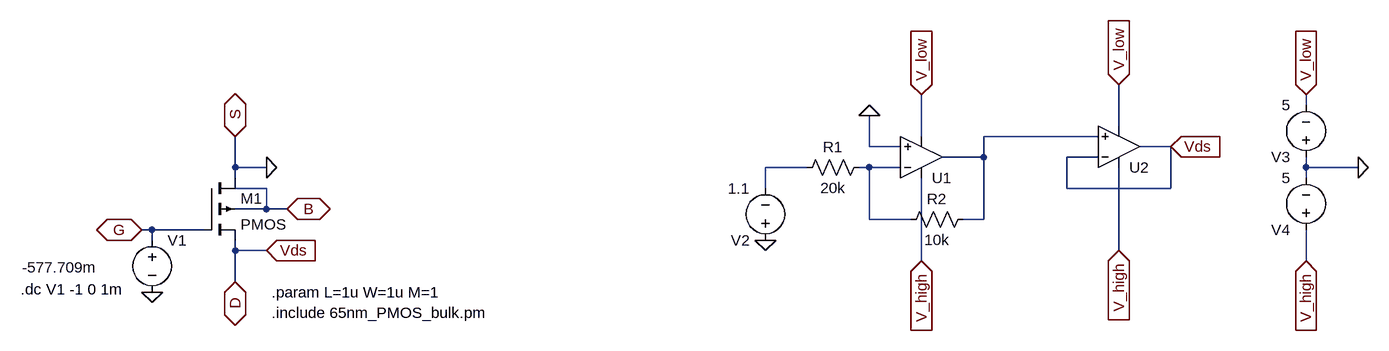
[diagram p0: schematic pmos65_trial1.asc]
pmos65_trial1.asc, the LTspice schematic file:
Version 4
SHEET 1 1956 680
WIRE 1856 0 1856 -16
WIRE 1568 32 1568 -32
WIRE 1264 48 1264 -16
WIRE 1536 48 1360 48
WIRE 1184 64 1184 16
WIRE 1232 64 1184 64
WIRE 1648 64 1600 64
WIRE 1360 80 1360 48
WIRE 1360 80 1296 80
WIRE 1536 80 1488 80
WIRE 208 96 208 48
WIRE 256 96 208 96
WIRE 1088 96 1024 96
WIRE 1184 96 1168 96
WIRE 1232 96 1184 96
WIRE 1856 96 1856 80
WIRE 1936 96 1856 96
WIRE 208 112 208 96
WIRE 1856 112 1856 96
WIRE 256 128 208 128
WIRE 1024 128 1024 96
WIRE 1488 128 1488 80
WIRE 1648 128 1648 64
WIRE 1648 128 1488 128
WIRE 256 160 256 128
WIRE 256 160 208 160
WIRE 288 160 256 160
WIRE 1184 176 1184 96
WIRE 1248 176 1184 176
WIRE 1360 176 1360 80
WIRE 1360 176 1328 176
WIRE 80 192 64 192
WIRE 160 192 80 192
WIRE 80 208 80 192
WIRE 208 224 208 208
WIRE 256 224 208 224
WIRE 1568 224 1568 96
WIRE 1264 240 1264 112
WIRE 1856 240 1856 192
WIRE 208 272 208 224
FLAG 64 192 G
IOPIN 64 192 BiDir
FLAG 208 272 D
IOPIN 208 272 BiDir
FLAG 208 48 S
IOPIN 208 48 BiDir
FLAG 288 160 B
IOPIN 288 160 BiDir
FLAG 80 288 0
FLAG 256 96 0
FLAG 256 224 Vds
IOPIN 256 224 In
FLAG 1184 16 0
FLAG 1024 208 0
FLAG 1936 96 0
FLAG 1856 -16 V_low
IOPIN 1856 -16 In
FLAG 1856 240 V_high
IOPIN 1856 240 In
FLAG 1264 -16 V_low
IOPIN 1264 -16 In
FLAG 1568 -32 V_low
IOPIN 1568 -32 In
FLAG 1568 224 V_high
IOPIN 1568 224 In
FLAG 1264 240 V_high
IOPIN 1264 240 In
FLAG 1648 64 Vds
IOPIN 1648 64 In
SYMBOL pmos4 160 112 R0
SYMATTR InstName M1
SYMATTR Value2 l={L} w={W} ad='2*65n*{W}' as='2*65n*{W}' pd='2*(2*65n+{W})' ps='2*(2*65n+{W})' m={M}
SYMBOL voltage 80 192 R0
WINDOW 3 -200 58 Left 2
WINDOW 123 0 0 Left 0
WINDOW 39 0 0 Left 0
SYMATTR InstName V1
SYMATTR Value -577.709m
SYMBOL voltage 1024 224 R180
WINDOW 123 0 0 Left 0
WINDOW 39 0 0 Left 0
SYMATTR InstName V2
SYMATTR Value 1.1
SYMBOL res 1184 80 R90
WINDOW 0 0 56 VBottom 2
WINDOW 3 32 56 VTop 2
SYMATTR InstName R1
SYMATTR Value 20k
SYMBOL res 1344 160 R90
WINDOW 0 0 56 VBottom 2
WINDOW 3 32 56 VTop 2
SYMATTR InstName R2
SYMATTR Value 10k
SYMBOL voltage 1856 96 R180
WINDOW 123 0 0 Left 0
WINDOW 39 0 0 Left 0
SYMATTR InstName V3
SYMATTR Value 5
SYMBOL voltage 1856 208 R180
WINDOW 123 0 0 Left 0
WINDOW 39 0 0 Left 0
SYMATTR InstName V4
SYMATTR Value 5
SYMBOL Opamps\\UniversalOpamp2 1264 80 M180
SYMATTR InstName U1
SYMBOL Opamps\\UniversalOpamp2 1568 64 M180
SYMATTR InstName U2
TEXT 264 288 Left 2 !.param L=1u W=1u M=1
TEXT 264 320 Left 2 !.include 65nm_PMOS_bulk.pm
TEXT -122 284 Left 2 !.dc V1 -1 0 1m

The netlist it stands for:
* pmos65_trial1.asc
M1 0 G Vds B PMOS l={L} w={W} ad='2*65n*{W}' as='2*65n*{W}' pd='2*(2*65n+{W})' ps='2*(2*65n+{W})' m={M}
V1 G 0 -577.709m
V2 0 N002 1.1
R1 N003 N002 20k
R2 N001 N003 10k
V3 0 V_low 5
V4 V_high 0 5
XU1 0 N003 V_high V_low N001 level.2 Avol=1Meg GBW=10Meg Slew=10Meg ilimit=25m rail=0 Vos=0 phimargin=45 en=0 enk=0 in=0 ink=0 Rin=500Meg  ; pins IN+ IN- V+ V- OUT
XU2 N001 Vds V_high V_low Vds level.2 Avol=1Meg GBW=10Meg Slew=10Meg ilimit=25m rail=0 Vos=0 phimargin=45 en=0 enk=0 in=0 ink=0 Rin=500Meg  ; pins IN+ IN- V+ V- OUT
.model NMOS NMOS
.model PMOS PMOS
.lib standard.mos
.param L=1u W=1u M=1
.include 65nm_PMOS_bulk.pm
.dc V1 -1 0 1m
.lib UniversalOpamps2.sub
.backanno
.end